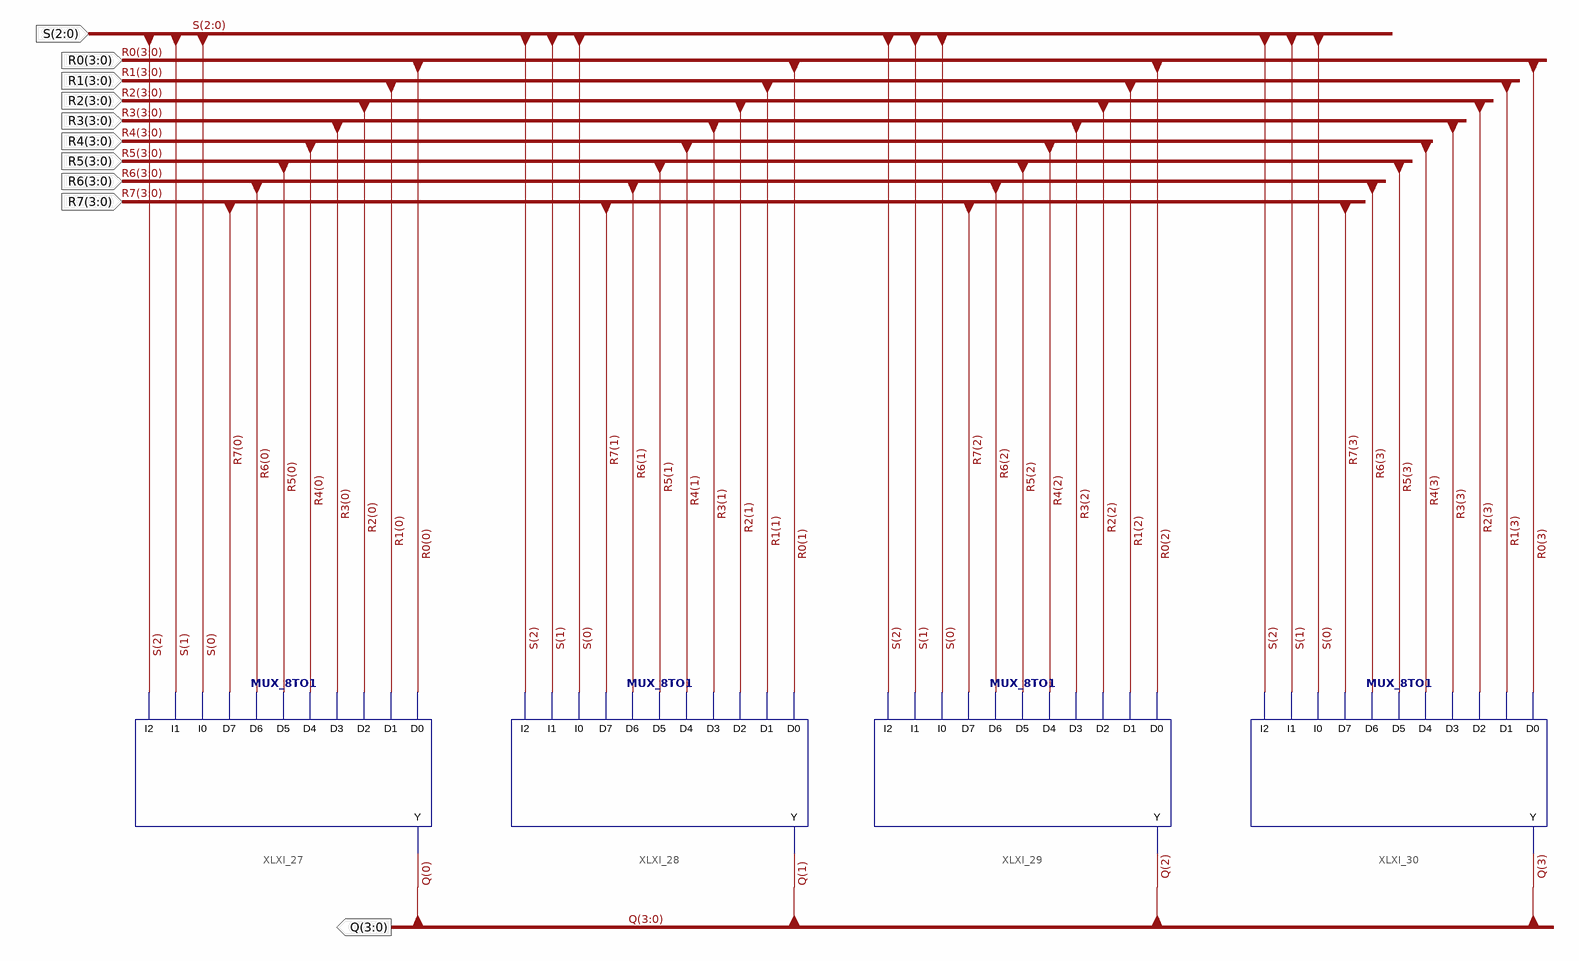
[diagram p0: schematic sheet 1]
// Xilinx ISE schematic MUX_8WAY4_BIT.sch (spartan3e) as structural Verilog: 4 symbols, 10 ports
module MUX_8WAY4_BIT (
  input  [2:0] S,
  input  [3:0] R0,
  input  [3:0] R1,
  input  [3:0] R2,
  input  [3:0] R3,
  input  [3:0] R4,
  input  [3:0] R5,
  input  [3:0] R6,
  input  [3:0] R7,
  output [3:0] Q
);

  MUX_8TO1 XLXI_27 (
    .D0(R0[0]), .D1(R1[0]), .D2(R2[0]), .D3(R3[0]), .D4(R4[0]), .D5(R5[0]), .D6(R6[0]), .D7(R7[0]),
    .I0(S[0]), .I1(S[1]), .I2(S[2]), .Y(Q[0]));
  MUX_8TO1 XLXI_28 (
    .D0(R0[1]), .D1(R1[1]), .D2(R2[1]), .D3(R3[1]), .D4(R4[1]), .D5(R5[1]), .D6(R6[1]), .D7(R7[1]),
    .I0(S[0]), .I1(S[1]), .I2(S[2]), .Y(Q[1]));
  MUX_8TO1 XLXI_29 (
    .D0(R0[2]), .D1(R1[2]), .D2(R2[2]), .D3(R3[2]), .D4(R4[2]), .D5(R5[2]), .D6(R6[2]), .D7(R7[2]),
    .I0(S[0]), .I1(S[1]), .I2(S[2]), .Y(Q[2]));
  MUX_8TO1 XLXI_30 (
    .D0(R0[3]), .D1(R1[3]), .D2(R2[3]), .D3(R3[3]), .D4(R4[3]), .D5(R5[3]), .D6(R6[3]), .D7(R7[3]),
    .I0(S[0]), .I1(S[1]), .I2(S[2]), .Y(Q[3]));
endmodule
